# Altium schematic sheet Fsociety_Keyboard_SCH_LED.SchDoc: NEW DESIGN
size A1; CompanyName: Rena Electronica; Engineer: IK; Organization: Rena Electronica; Address1: de Ambachten 12; Address2: 4881 XZ; Address3: Zundert; Address4: the Netherlands; DocumentNumber: 05.xxx; Revision: 0.10; Customer: Klantnaam; PageSetup: Record=PageOptions|CenterHorizontal=True|CenterVertical=True|PrintScale=0.52|XCorrection=1.00|YCorrection=1.00|PrintKind=0|BorderSize=5000000|LeftOffset=0|BottomOffset=0|Orientation=2|PaperLength=1000|PaperWidth=1000|Scale=100|PaperSource=7|PrintQuality=-3|MediaType=1|DitherType=10|PrintScaleMode=1|PaperKind=A3|PaperIndex=8; ProjectName: R_NAAM.PRJ
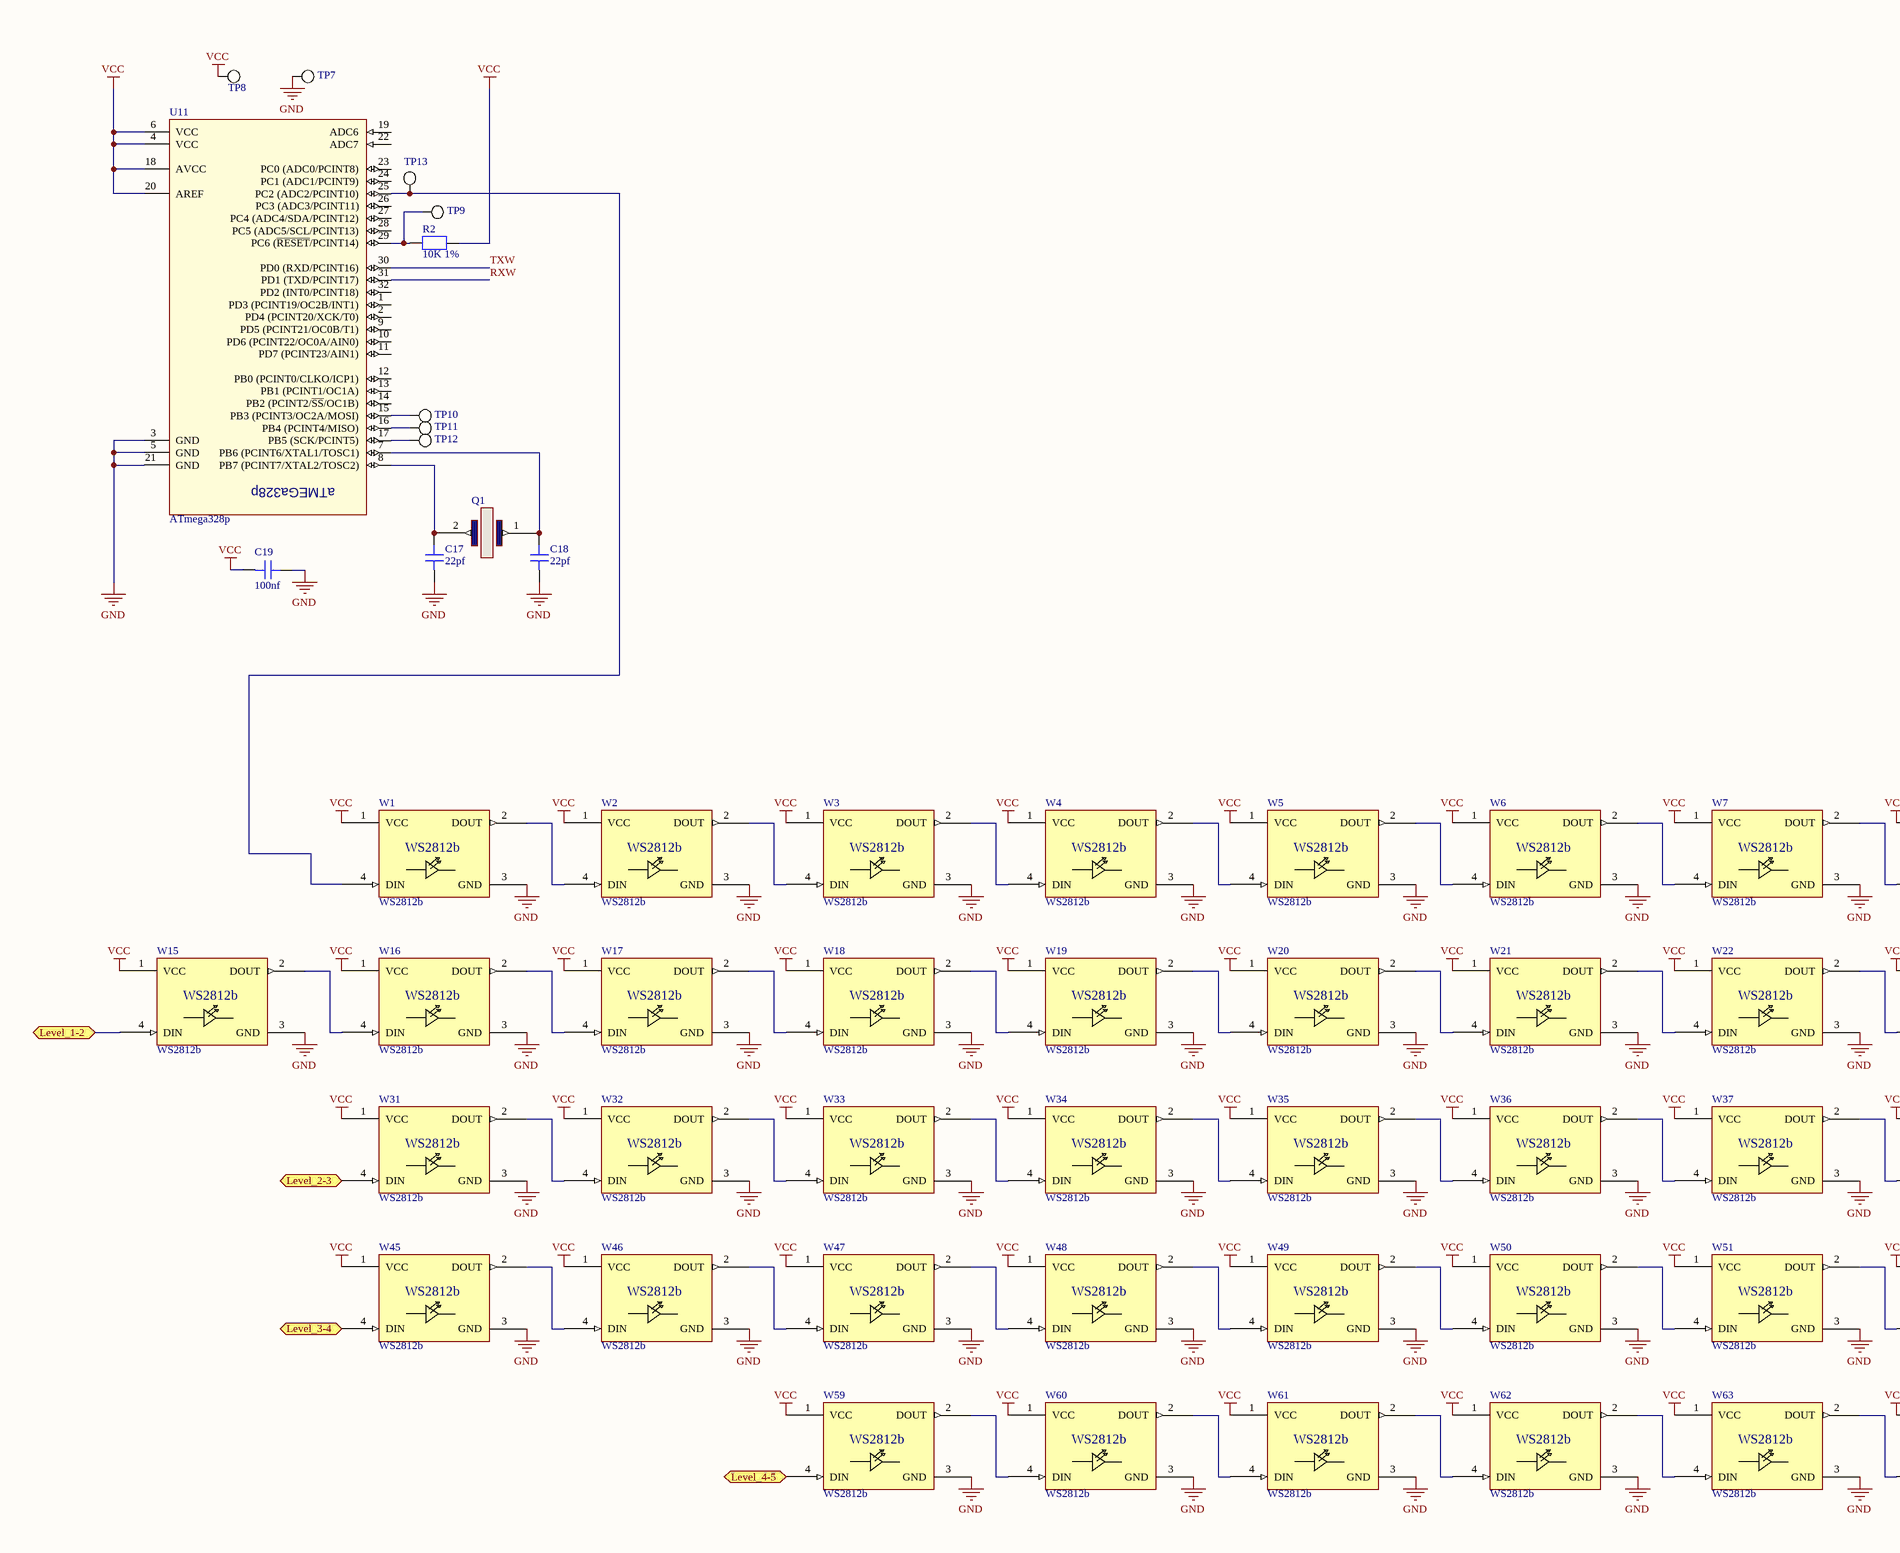
[diagram p0: Fsociety_Keyboard_SCH_LED.SchDoc, left]
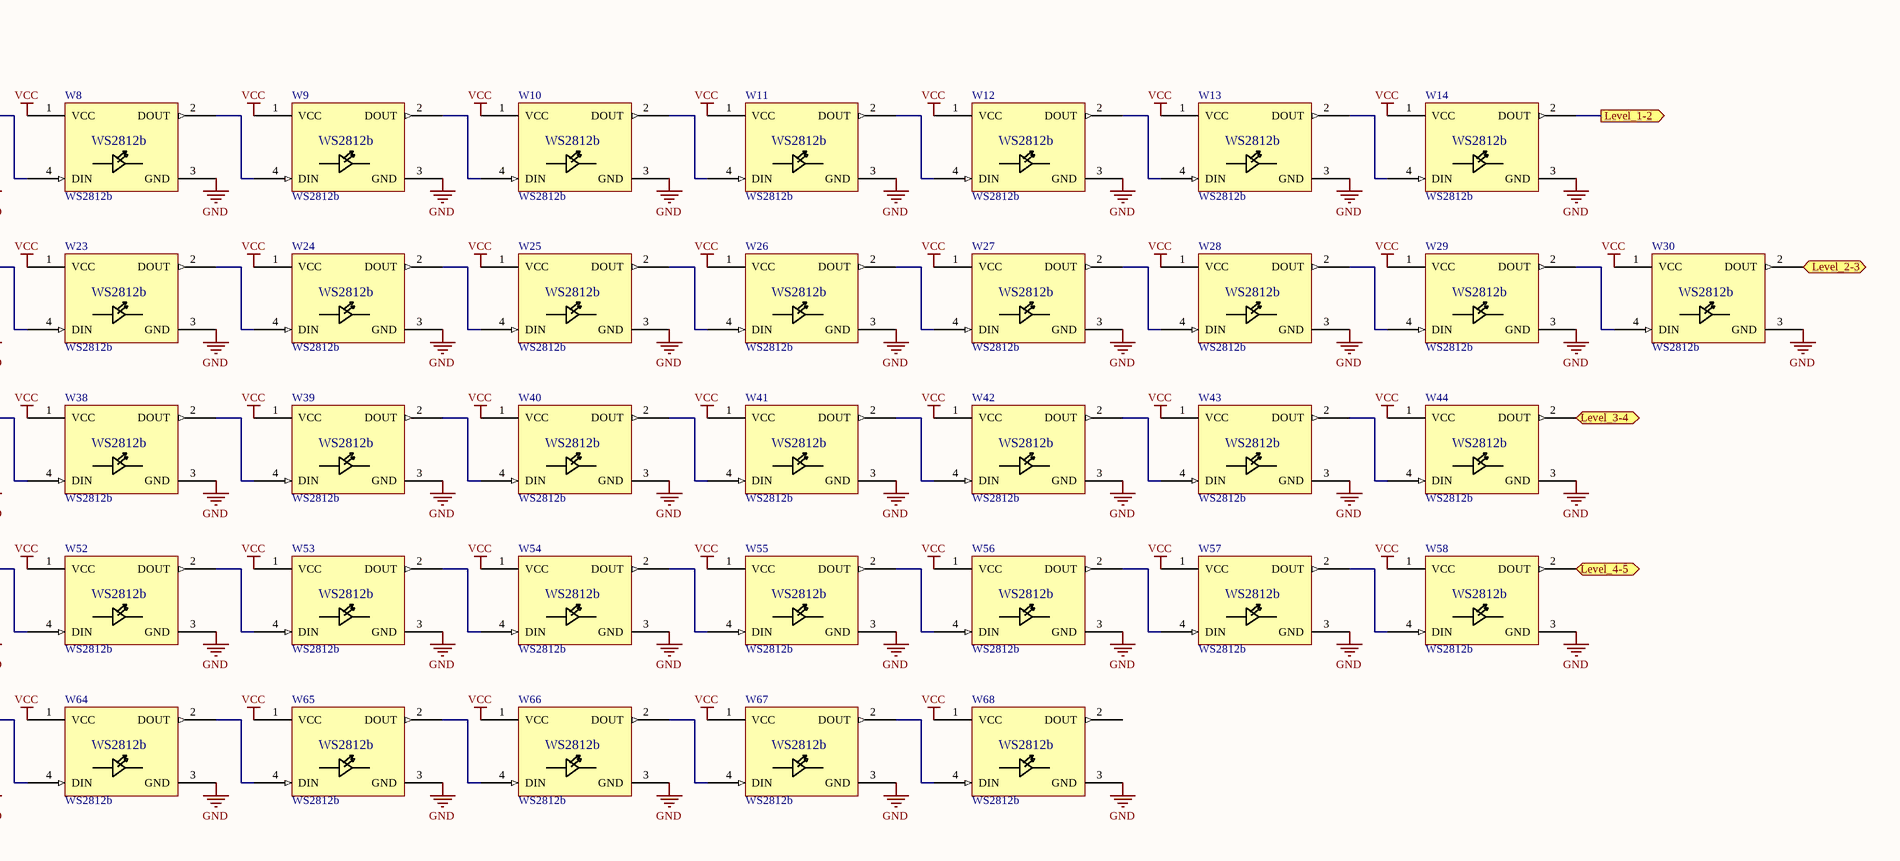
[diagram p1: Fsociety_Keyboard_SCH_LED.SchDoc, right]

## Parts
C17  22pf  [CAPC1608X08_NR]
C18  22pf  [CAPC1608X08_NR]
C19  100nf  [CAPC1608X08_NR]
Q1  Crystal_txc_sumasta  [Crystal_txc_sumasta]  (value not drawn)
R2  10K 1%  [RESC1608X06_NR]
TP7  TP  [TESTPAD-2MM]  (value not drawn)  (no BOM)
TP8  TP  [TESTPAD-2MM]  (value not drawn)  (no BOM)
TP9  TP  [TESTPAD-2MM]  (value not drawn)  (no BOM)
TP10  TP  [TESTPAD-2MM]  (value not drawn)  (no BOM)
TP11  TP  [TESTPAD-2MM]  (value not drawn)  (no BOM)
TP12  TP  [TESTPAD-2MM]  (value not drawn)  (no BOM)
TP13  TP  [TESTPAD-2MM]  (value not drawn)  (no BOM)
U11  ATmega328p  [TQFP32]
W1  WS2812b  [DIOC500500X250_NR]
W2  WS2812b  [DIOC500500X250_NR]
W3  WS2812b  [DIOC500500X250_NR]
W4  WS2812b  [DIOC500500X250_NR]
W5  WS2812b  [DIOC500500X250_NR]
W6  WS2812b  [DIOC500500X250_NR]
W7  WS2812b  [DIOC500500X250_NR]
W8  WS2812b  [DIOC500500X250_NR]
W9  WS2812b  [DIOC500500X250_NR]
W10  WS2812b  [DIOC500500X250_NR]
W11  WS2812b  [DIOC500500X250_NR]
W12  WS2812b  [DIOC500500X250_NR]
W13  WS2812b  [DIOC500500X250_NR]
W14  WS2812b  [DIOC500500X250_NR]
W15  WS2812b  [DIOC500500X250_NR]
W16  WS2812b  [DIOC500500X250_NR]
W17  WS2812b  [DIOC500500X250_NR]
W18  WS2812b  [DIOC500500X250_NR]
W19  WS2812b  [DIOC500500X250_NR]
W20  WS2812b  [DIOC500500X250_NR]
W21  WS2812b  [DIOC500500X250_NR]
W22  WS2812b  [DIOC500500X250_NR]
W23  WS2812b  [DIOC500500X250_NR]
W24  WS2812b  [DIOC500500X250_NR]
W25  WS2812b  [DIOC500500X250_NR]
W26  WS2812b  [DIOC500500X250_NR]
W27  WS2812b  [DIOC500500X250_NR]
W28  WS2812b  [DIOC500500X250_NR]
W29  WS2812b  [DIOC500500X250_NR]
W30  WS2812b  [DIOC500500X250_NR]
W31  WS2812b  [DIOC500500X250_NR]
W32  WS2812b  [DIOC500500X250_NR]
W33  WS2812b  [DIOC500500X250_NR]
W34  WS2812b  [DIOC500500X250_NR]
W35  WS2812b  [DIOC500500X250_NR]
W36  WS2812b  [DIOC500500X250_NR]
W37  WS2812b  [DIOC500500X250_NR]
W38  WS2812b  [DIOC500500X250_NR]
W39  WS2812b  [DIOC500500X250_NR]
W40  WS2812b  [DIOC500500X250_NR]
W41  WS2812b  [DIOC500500X250_NR]
W42  WS2812b  [DIOC500500X250_NR]
W43  WS2812b  [DIOC500500X250_NR]
W44  WS2812b  [DIOC500500X250_NR]
W45  WS2812b  [DIOC500500X250_NR]
W46  WS2812b  [DIOC500500X250_NR]
W47  WS2812b  [DIOC500500X250_NR]
W48  WS2812b  [DIOC500500X250_NR]
W49  WS2812b  [DIOC500500X250_NR]
W50  WS2812b  [DIOC500500X250_NR]
W51  WS2812b  [DIOC500500X250_NR]
W52  WS2812b  [DIOC500500X250_NR]
W53  WS2812b  [DIOC500500X250_NR]
W54  WS2812b  [DIOC500500X250_NR]
W55  WS2812b  [DIOC500500X250_NR]
W56  WS2812b  [DIOC500500X250_NR]
W57  WS2812b  [DIOC500500X250_NR]
W58  WS2812b  [DIOC500500X250_NR]
W59  WS2812b  [DIOC500500X250_NR]
W60  WS2812b  [DIOC500500X250_NR]
W61  WS2812b  [DIOC500500X250_NR]
W62  WS2812b  [DIOC500500X250_NR]
W63  WS2812b  [DIOC500500X250_NR]
W64  WS2812b  [DIOC500500X250_NR]
W65  WS2812b  [DIOC500500X250_NR]
W66  WS2812b  [DIOC500500X250_NR]
W67  WS2812b  [DIOC500500X250_NR]
W68  WS2812b  [DIOC500500X250_NR]

## Ports
Level_1-2, Level_1-2 (out), Level_2-3, Level_3-4, Level_4-5

## Nets
GND: C17.1 C18.1 C19.2 TP7.1 U11.3(GND) U11.5(GND) U11.21(GND) W1.3(GND) W2.3(GND) W3.3(GND) W4.3(GND) W5.3(GND) W6.3(GND) W7.3(GND) W8.3(GND) W9.3(GND) W10.3(GND) W11.3(GND) W12.3(GND) W13.3(GND) W14.3(GND) W15.3(GND) W16.3(GND) W17.3(GND) W18.3(GND) W19.3(GND) W20.3(GND) W21.3(GND) W22.3(GND) W23.3(GND) W24.3(GND) W25.3(GND) W26.3(GND) W27.3(GND) W28.3(GND) W29.3(GND) W30.3(GND) W31.3(GND) W32.3(GND) W33.3(GND) W34.3(GND) W35.3(GND) W36.3(GND) W37.3(GND) W38.3(GND) W39.3(GND) W40.3(GND) W41.3(GND) W42.3(GND) W43.3(GND) W44.3(GND) W45.3(GND) W46.3(GND) W47.3(GND) W48.3(GND) W49.3(GND) W50.3(GND) W51.3(GND) W52.3(GND) W53.3(GND) W54.3(GND) W55.3(GND) W56.3(GND) W57.3(GND) W58.3(GND) W59.3(GND) W60.3(GND) W61.3(GND) W62.3(GND) W63.3(GND) W64.3(GND) W65.3(GND) W66.3(GND) W67.3(GND) W68.3(GND)
VCC: C19.1 R2.1 TP8.1 U11.4(VCC) U11.6(VCC) U11.18(AVCC) U11.20(AREF) W1.1(VCC) W2.1(VCC) W3.1(VCC) W4.1(VCC) W5.1(VCC) W6.1(VCC) W7.1(VCC) W8.1(VCC) W9.1(VCC) W10.1(VCC) W11.1(VCC) W12.1(VCC) W13.1(VCC) W14.1(VCC) W15.1(VCC) W16.1(VCC) W17.1(VCC) W18.1(VCC) W19.1(VCC) W20.1(VCC) W21.1(VCC) W22.1(VCC) W23.1(VCC) W24.1(VCC) W25.1(VCC) W26.1(VCC) W27.1(VCC) W28.1(VCC) W29.1(VCC) W30.1(VCC) W31.1(VCC) W32.1(VCC) W33.1(VCC) W34.1(VCC) W35.1(VCC) W36.1(VCC) W37.1(VCC) W38.1(VCC) W39.1(VCC) W40.1(VCC) W41.1(VCC) W42.1(VCC) W43.1(VCC) W44.1(VCC) W45.1(VCC) W46.1(VCC) W47.1(VCC) W48.1(VCC) W49.1(VCC) W50.1(VCC) W51.1(VCC) W52.1(VCC) W53.1(VCC) W54.1(VCC) W55.1(VCC) W56.1(VCC) W57.1(VCC) W58.1(VCC) W59.1(VCC) W60.1(VCC) W61.1(VCC) W62.1(VCC) W63.1(VCC) W64.1(VCC) W65.1(VCC) W66.1(VCC) W67.1(VCC) W68.1(VCC)
Level_1-2: W14.2(DOUT) W15.4(DIN) ; port Level_1-2
Level_2-3: W30.2(DOUT) W31.4(DIN) ; port Level_2-3
Level_3-4: W44.2(DOUT) W45.4(DIN) ; port Level_3-4
Level_4-5: W58.2(DOUT) W59.4(DIN) ; port Level_4-5
RXW: U11.31(PD1_(TXD/PCINT17))
TXW: U11.30(PD0_(RXD/PCINT16))
NetC17_2: C17.2 Q1.2 U11.8(PB7_(PCINT7/XTAL2/TOSC2))
NetC18_2: C18.2 Q1.1 U11.7(PB6_(PCINT6/XTAL1/TOSC1))
NetR2_2: R2.2 TP9.1 U11.29(PC6_(~{RESET}/PCINT14))
NetTP10_1: TP10.1 U11.15(PB3_(PCINT3/OC2A/MOSI))
NetTP11_1: TP11.1 U11.16(PB4_(PCINT4/MISO))
NetTP12_1: TP12.1 U11.17(PB5_(SCK/PCINT5))
NetTP13_1: TP13.1 U11.25(PC2_(ADC2/PCINT10)) W1.4(DIN)
NetW1_2: W1.2(DOUT) W2.4(DIN)
NetW2_2: W2.2(DOUT) W3.4(DIN)
NetW3_2: W3.2(DOUT) W4.4(DIN)
NetW4_2: W4.2(DOUT) W5.4(DIN)
NetW5_2: W5.2(DOUT) W6.4(DIN)
NetW6_2: W6.2(DOUT) W7.4(DIN)
NetW7_2: W7.2(DOUT) W8.4(DIN)
NetW8_2: W8.2(DOUT) W9.4(DIN)
NetW9_2: W9.2(DOUT) W10.4(DIN)
NetW10_2: W10.2(DOUT) W11.4(DIN)
NetW11_2: W11.2(DOUT) W12.4(DIN)
NetW12_2: W12.2(DOUT) W13.4(DIN)
NetW13_2: W13.2(DOUT) W14.4(DIN)
NetW15_2: W15.2(DOUT) W16.4(DIN)
NetW16_2: W16.2(DOUT) W17.4(DIN)
NetW17_2: W17.2(DOUT) W18.4(DIN)
NetW18_2: W18.2(DOUT) W19.4(DIN)
NetW19_2: W19.2(DOUT) W20.4(DIN)
NetW20_2: W20.2(DOUT) W21.4(DIN)
NetW21_2: W21.2(DOUT) W22.4(DIN)
NetW22_2: W22.2(DOUT) W23.4(DIN)
NetW23_2: W23.2(DOUT) W24.4(DIN)
NetW24_2: W24.2(DOUT) W25.4(DIN)
NetW25_2: W25.2(DOUT) W26.4(DIN)
NetW26_2: W26.2(DOUT) W27.4(DIN)
NetW27_2: W27.2(DOUT) W28.4(DIN)
NetW28_2: W28.2(DOUT) W29.4(DIN)
NetW29_2: W29.2(DOUT) W30.4(DIN)
NetW31_2: W31.2(DOUT) W32.4(DIN)
NetW32_2: W32.2(DOUT) W33.4(DIN)
NetW33_2: W33.2(DOUT) W34.4(DIN)
NetW34_2: W34.2(DOUT) W35.4(DIN)
NetW35_2: W35.2(DOUT) W36.4(DIN)
NetW36_2: W36.2(DOUT) W37.4(DIN)
NetW37_2: W37.2(DOUT) W38.4(DIN)
NetW38_2: W38.2(DOUT) W39.4(DIN)
NetW39_2: W39.2(DOUT) W40.4(DIN)
NetW40_2: W40.2(DOUT) W41.4(DIN)
NetW41_2: W41.2(DOUT) W42.4(DIN)
NetW42_2: W42.2(DOUT) W43.4(DIN)
NetW43_2: W43.2(DOUT) W44.4(DIN)
NetW45_2: W45.2(DOUT) W46.4(DIN)
NetW46_2: W46.2(DOUT) W47.4(DIN)
NetW47_2: W47.2(DOUT) W48.4(DIN)
NetW48_2: W48.2(DOUT) W49.4(DIN)
NetW49_2: W49.2(DOUT) W50.4(DIN)
NetW50_2: W50.2(DOUT) W51.4(DIN)
NetW51_2: W51.2(DOUT) W52.4(DIN)
NetW52_2: W52.2(DOUT) W53.4(DIN)
NetW53_2: W53.2(DOUT) W54.4(DIN)
NetW54_2: W54.2(DOUT) W55.4(DIN)
NetW55_2: W55.2(DOUT) W56.4(DIN)
NetW56_2: W56.2(DOUT) W57.4(DIN)
NetW57_2: W57.2(DOUT) W58.4(DIN)
NetW59_2: W59.2(DOUT) W60.4(DIN)
NetW60_2: W60.2(DOUT) W61.4(DIN)
NetW61_2: W61.2(DOUT) W62.4(DIN)
NetW62_2: W62.2(DOUT) W63.4(DIN)
NetW63_2: W63.2(DOUT) W64.4(DIN)
NetW64_2: W64.2(DOUT) W65.4(DIN)
NetW65_2: W65.2(DOUT) W66.4(DIN)
NetW66_2: W66.2(DOUT) W67.4(DIN)
NetW67_2: W67.2(DOUT) W68.4(DIN)

Not connected (* = marked no-connect by the designer): U11 1(PD3_(PCINT19/OC2B/INT1)) 2(PD4_(PCINT20/XCK/T0)) 9(PD5_(PCINT21/OC0B/T1)) 10(PD6_(PCINT22/OC0A/AIN0)) 11(PD7_(PCINT23/AIN1)) 12(PB0_(PCINT0/CLKO/ICP1)) 13(PB1_(PCINT1/OC1A)) 14(PB2_(PCINT2/~{SS}/OC1B)) 19(ADC6) 22(ADC7) 23(PC0_(ADC0/PCINT8)) 24(PC1_(ADC1/PCINT9)) 26(PC3_(ADC3/PCINT11)) 27(PC4_(ADC4/SDA/PCINT12)) 28(PC5_(ADC5/SCL/PCINT13)) 32(PD2_(INT0/PCINT18)); W68 2(DOUT)

## Notes on the sheet
- (in symbol ATmega328p) aTMEGa328p

## Library data of the parts
C17-C19 = CMP-00064-A.5: Capacitor 10nF X7R ±10% 50V 0603(1608) SMD; MAXPartNumber: 10N/50-0603!; Case-EIA: 0603; Case-Metric: 1608; Value: 10nF; Dielectric Characteristic: X7R; Thickness (max): 0.9mm; Tolerance: ±10%; Voltage: 50V
R2 = CMP-00060-A.4: 10K  0.1W 1% 0603(1608 Metric) SMD; MaxPartNumber: 10K-0603!; Case-EIA: 0603; Case-Metric: 1608; Value: 10K Ohm; Power: 0.1W; Technology: SMT; Tolerance: 1%; FLS_PN: 10K-0603!; RENA_PN: 10K-0603!
TP7-TP13 = CMP-00759-A.11: TESTPOINT; FLS_PN: TP#; RENA_PN: TP#; MAXPartNumber: TP#; ComponentLink1Description: Manufacturer URL; ComponentLink2Description: Datasheet; ComponentLink3Description: Package Specification
W1-W68 = WS2812b_Sumasta: The Infamous Chinese Chainable RGB LED